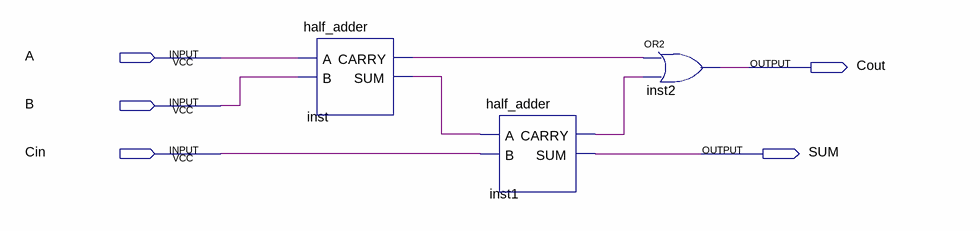
[diagram p0: schematic sheet]
// Quartus schematic full_adder.bdf as structural Verilog: 3 symbols, 5 pins
module full_adder (
  input  A,
  input  B,
  input  Cin,
  output Cout,
  output SUM
);

  wire inst1_carry, inst_carry, inst_sum;

  half_adder inst (.A(A), .B(B), .CARRY(inst_carry), .SUM(inst_sum));
  half_adder inst1 (.A(inst_sum), .B(Cin), .CARRY(inst1_carry), .SUM(SUM));
  or inst2 (Cout, inst_carry, inst1_carry);
endmodule
